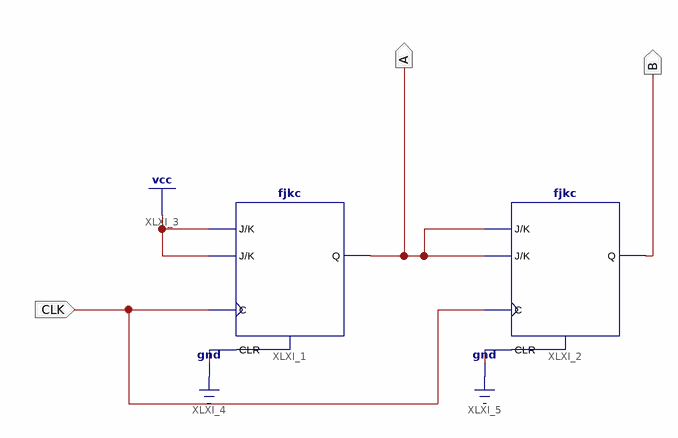
[diagram p0: schematic sheet 1]
// Xilinx ISE schematic counter03.sch (spartan6) as structural Verilog: 2 symbols, 3 ports
module counter03 (
  input  CLK,
  output A,
  output B
);

  fjkc XLXI_1 (.C(CLK), .CLR(1'b0), .J(1'b1), .K(1'b1), .Q(A));
  fjkc XLXI_2 (.C(CLK), .CLR(1'b0), .J(A), .K(A), .Q(B));
endmodule
